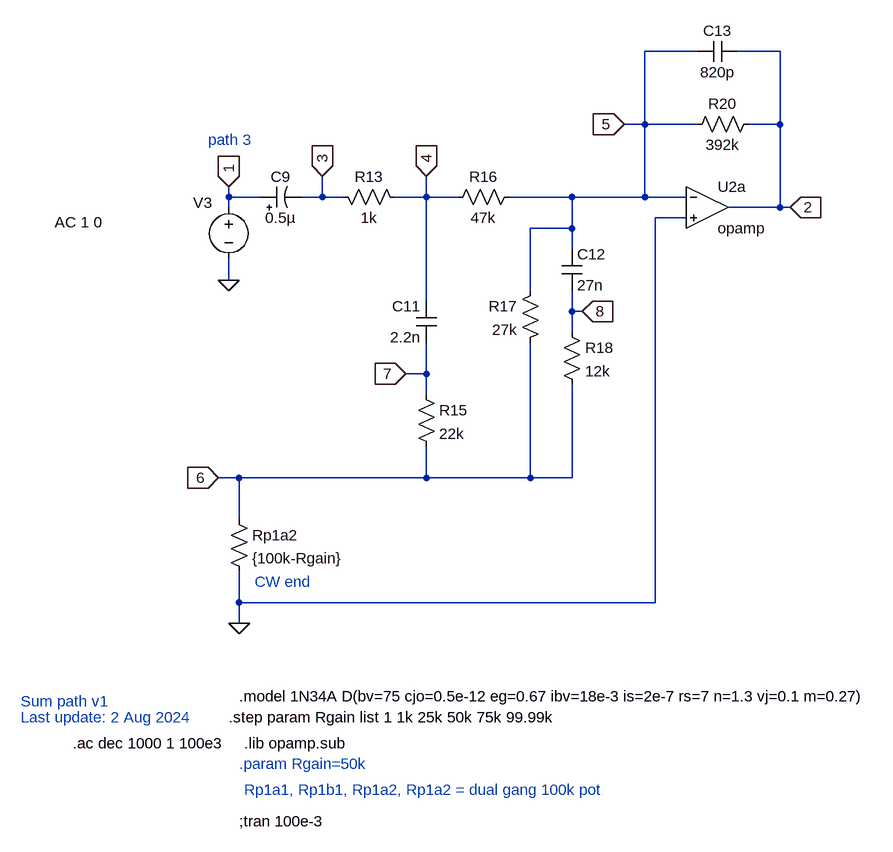
[diagram p0: schematic Klon-Centaur_sum_path3_v1.asc]
Klon-Centaur_sum_path3_v1.asc, the LTspice schematic file:
Version 4
SHEET 1 4496 5064
WIRE 736 2272 656 2272
WIRE 864 2272 800 2272
WIRE 656 2384 656 2272
WIRE 656 2384 624 2384
WIRE 736 2384 656 2384
WIRE 864 2384 864 2272
WIRE 864 2384 816 2384
WIRE 16 2496 16 2480
WIRE 64 2496 16 2496
WIRE 160 2496 160 2464
WIRE 160 2496 128 2496
WIRE 192 2496 160 2496
WIRE 320 2496 320 2464
WIRE 320 2496 272 2496
WIRE 368 2496 320 2496
WIRE 544 2496 448 2496
WIRE 656 2496 656 2384
WIRE 656 2496 544 2496
WIRE 720 2496 656 2496
WIRE 16 2512 16 2496
WIRE 864 2512 864 2384
WIRE 864 2512 784 2512
WIRE 880 2512 864 2512
WIRE 720 2528 672 2528
WIRE 544 2544 544 2496
WIRE 544 2544 480 2544
WIRE 544 2576 544 2544
WIRE 16 2624 16 2592
WIRE 480 2640 480 2544
WIRE 320 2656 320 2496
WIRE 544 2672 544 2640
WIRE 560 2672 544 2672
WIRE 544 2704 544 2672
WIRE 320 2768 320 2720
WIRE 320 2768 288 2768
WIRE 320 2800 320 2768
WIRE 32 2928 0 2928
WIRE 320 2928 320 2880
WIRE 320 2928 32 2928
WIRE 480 2928 480 2720
WIRE 480 2928 320 2928
WIRE 544 2928 544 2784
WIRE 544 2928 480 2928
WIRE 32 2992 32 2928
WIRE 32 3120 32 3072
WIRE 672 3120 672 2528
WIRE 672 3120 32 3120
WIRE 32 3152 32 3120
FLAG 880 2512 2
IOPIN 880 2512 In
FLAG 32 3152 0
FLAG 160 2464 3
IOPIN 160 2464 In
FLAG 320 2464 4
IOPIN 320 2464 In
FLAG 288 2768 7
IOPIN 288 2768 In
FLAG 560 2672 8
IOPIN 560 2672 In
FLAG 0 2928 6
IOPIN 0 2928 In
FLAG 624 2384 5
IOPIN 624 2384 In
FLAG 16 2480 1
IOPIN 16 2480 In
FLAG 16 2624 0
SYMBOL res 16 2976 R0
SYMATTR InstName Rp1a2
SYMATTR Value {100k-Rgain}
SYMBOL res 288 2512 M270
WINDOW 0 32 56 VTop 2
WINDOW 3 0 56 VBottom 2
SYMATTR InstName R13
SYMATTR Value 1k
SYMBOL cap 336 2656 M0
SYMATTR InstName C11
SYMATTR Value 2.2n
SYMBOL res 304 2784 R0
SYMATTR InstName R15
SYMATTR Value 22k
SYMBOL res 496 2624 M0
SYMATTR InstName R17
SYMATTR Value 27k
SYMBOL res 528 2688 R0
SYMATTR InstName R18
SYMATTR Value 12k
SYMBOL cap 528 2576 R0
SYMATTR InstName C12
SYMATTR Value 27n
SYMBOL res 464 2480 R90
WINDOW 0 0 56 VBottom 2
WINDOW 3 32 56 VTop 2
SYMATTR InstName R16
SYMATTR Value 47k
SYMBOL res 832 2368 R90
WINDOW 0 0 56 VBottom 2
WINDOW 3 32 56 VTop 2
SYMATTR InstName R20
SYMATTR Value 392k
SYMBOL cap 800 2256 R90
WINDOW 0 0 32 VBottom 2
WINDOW 3 32 32 VTop 2
SYMATTR InstName C13
SYMATTR Value 820p
SYMBOL OpAmps\\opamp 752 2448 R0
SYMATTR InstName U2a
SYMBOL polcap 64 2512 R270
WINDOW 0 32 32 VTop 2
WINDOW 3 0 32 VBottom 2
SYMATTR InstName C9
SYMATTR Value 0.5µ
SYMBOL voltage 16 2496 R0
WINDOW 0 -55 9 Left 2
WINDOW 123 -268 39 Left 2
WINDOW 39 0 0 Left 0
WINDOW 3 -493 7 Left 2
SYMATTR InstName V3
SYMATTR Value2 AC 1 0
SYMATTR Value ""
TEXT 40 3336 Left 2 !.lib opamp.sub
TEXT -224 3336 Left 2 !.ac dec 1000 1 100e3
TEXT 56 3088 Left 2 ;CW end
TEXT 16 3296 Left 2 !.step param Rgain list 1 1k 25k 50k 75k 99.99k
TEXT 40 3408 Left 2 ;Rp1a1, Rp1b1, Rp1a2, Rp1a2 = dual gang 100k pot
TEXT 32 3264 Left 2 !.model 1N34A D(bv=75 cjo=0.5e-12 eg=0.67 ibv=18e-3 is=2e-7 rs=7 n=1.3 vj=0.1 m=0.27)
TEXT 32 3456 Left 2 !;tran 100e-3
TEXT 32 3368 Left 2 ;.param Rgain=50k
TEXT -304 3272 Left 2 ;Sum path v1
TEXT -16 2408 Left 2 ;path 3
TEXT -304 3296 Left 2 ;Last update: 2 Aug 2024

The netlist it stands for:
* Klon-Centaur_sum_path3_v1.asc
Rp1a2 6 0 {100k-Rgain}
R13 4 3 1k
C11 4 7 2.2n
R15 7 6 22k
R17 5 6 27k
R18 8 6 12k
C12 5 8 27n
R16 5 4 47k
R20 2 5 392k
C13 2 5 820p
XU2a 5 0 2 opamp Aol=100K GBW=10Meg  ; pins invin noninvin out
C9 1 3 0.5µ
V3 1 0 AC 1 0
.lib opamp.sub
.ac dec 1000 1 100e3
* CW end
.step param Rgain list 1 1k 25k 50k 75k 99.99k
* Rp1a1, Rp1b1, Rp1a2, Rp1a2 = dual gang 100k pot
.model 1N34A D(bv=75 cjo=0.5e-12 eg=0.67 ibv=18e-3 is=2e-7 rs=7 n=1.3 vj=0.1 m=0.27)
;tran 100e-3
* .param Rgain=50k
* Sum path v1
* path 3
* Last update: 2 Aug 2024
.backanno
.end